# Altium schematic sheet controller.SchDoc: Sunrise Alarm (Clusterwink)
size A4
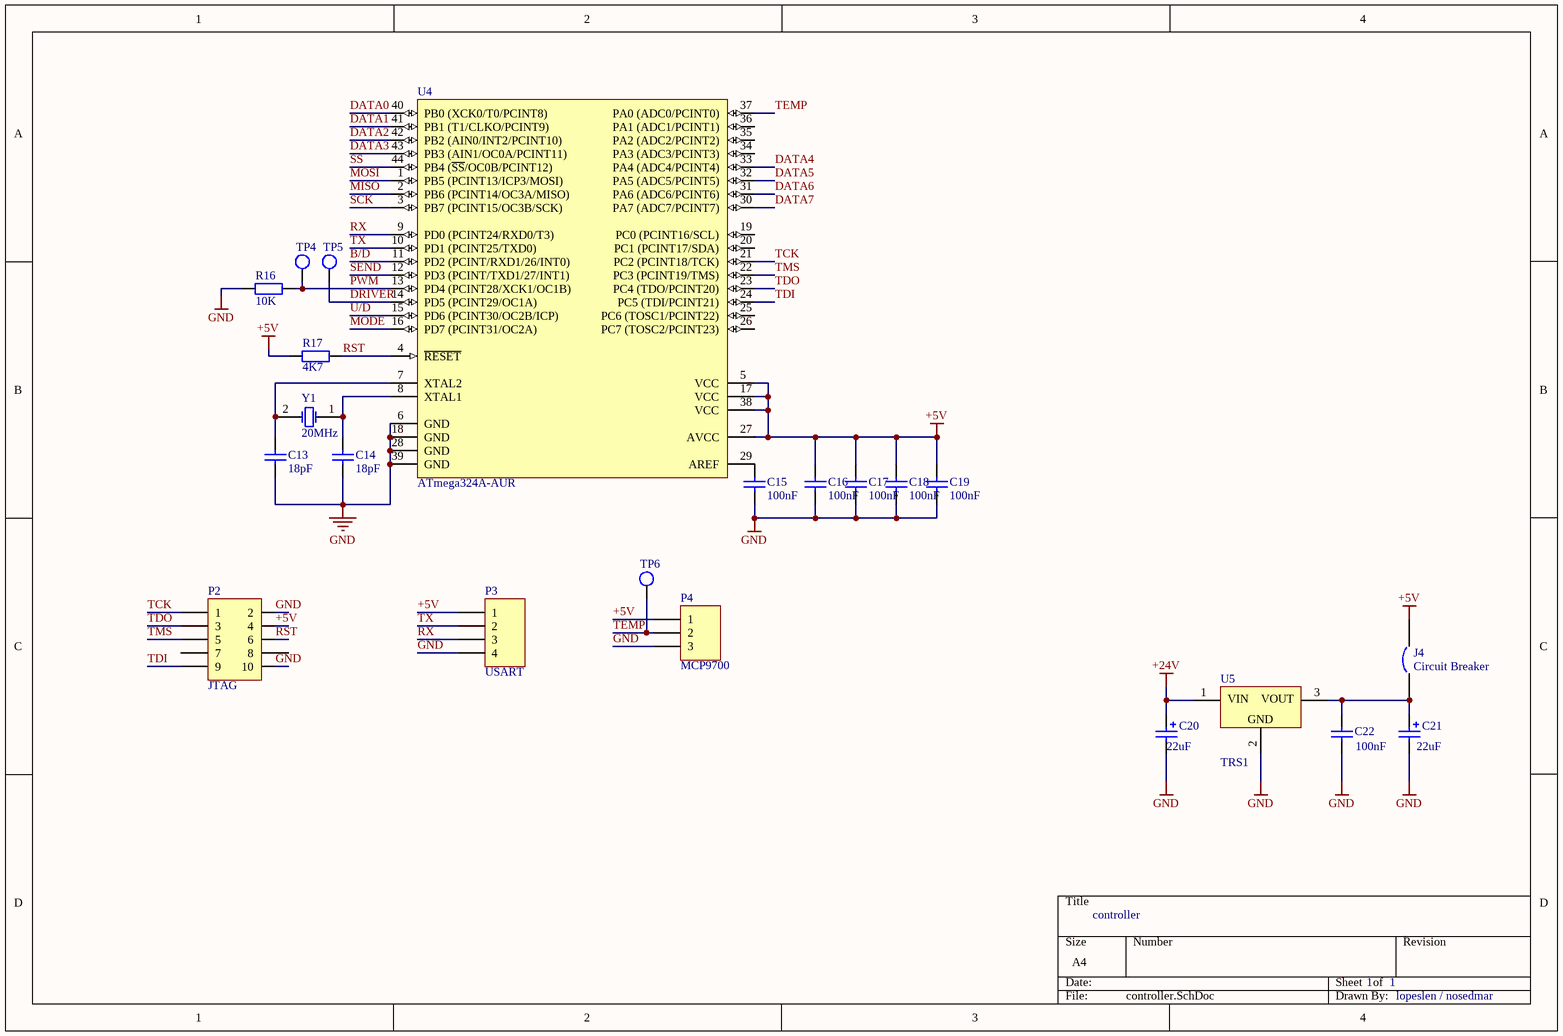
[diagram p0: controller.SchDoc]

## Parts
C13  value 18pF  [6-0805_M]  (hidden comment: Cap)
C14  value 18pF  [6-0805_M]  (hidden comment: Cap)
C15  value 100nF  [6-0805_M]  (hidden comment: Cap)
C16  value 100nF  [6-0805_M]  (hidden comment: Cap)
C17  value 100nF  [6-0805_M]  (hidden comment: Cap)
C18  value 100nF  [6-0805_M]  (hidden comment: Cap)
C19  value 100nF  [6-0805_M]  (hidden comment: Cap)
C20  value 22uF  [EEEFK1H]  (hidden comment: Cap Pol2)
C21  value 22uF  [EEEFK1H]  (hidden comment: Cap Pol2)
C22  value 100nF  [6-0805_M]  (hidden comment: Cap)
J4  Circuit Breaker  [SOLDER_JUMPER_24mil]
P2  JTAG  [HDR2X5]
P3  USART  [HDR1X4]
P4  MCP9700  [HDR1X3]
R16  value 10K  [6-0805_M]  (hidden comment: Res2)
R17  value 4K7  [6-0805_M]  (hidden comment: Res2)
TP4  TestPoint  [MEASUREMENT_POINT]  (value not drawn)
TP5  TestPoint  [MEASUREMENT_POINT]  (value not drawn)
TP6  TestPoint  [MEASUREMENT_POINT]  (value not drawn)
U4  ATmega324A-AUR  [44A_N]
U5  TRS1  [TSR1-2450]
Y1  20MHz  [CRYSTAL]

## Nets
+5V: C16.2 C17.2 C18.2 C19.2 J4.2 P2.4 P3.1 P4.1 R17.2 U4.5(VCC) U4.17(VCC) U4.27(AVCC) U4.38(VCC)
+24V: C20.1 U5.1(+VIN)
GND: C13.1 C14.1 C15.1 C16.1 C17.1 C18.1 C19.1 C20.2 C21.2 C22.1 P2.2 P2.10 P3.4 P4.3 R16.2 U4.6(GND) U4.18(GND) U4.28(GND) U4.39(GND) U5.2(GND)
~{B}/D: U4.11(PD2_(PCINT/RXD1/26/INT0))
DATA0: U4.40(PB0_(XCK0/T0/PCINT8))
DATA1: U4.41(PB1_(T1/CLKO/PCINT9))
DATA2: U4.42(PB2_(AIN0/INT2/PCINT10))
DATA3: U4.43(PB3_(AIN1/OC0A/PCINT11))
DATA4: U4.33(PA4_(ADC4/PCINT4))
DATA5: U4.32(PA5_(ADC5/PCINT5))
DATA6: U4.31(PA6_(ADC6/PCINT6))
DATA7: U4.30(PA7_(ADC7/PCINT7))
DRIVER: TP5.1 U4.14(PD5_(PCINT29/OC1A))
MISO: U4.2(PB6_(PCINT14/OC3A/MISO))
MODE: U4.16(PD7_(PCINT31/OC2A))
MOSI: U4.1(PB5_(PCINT13/ICP3/MOSI))
PWM: R16.1 TP4.1 U4.13(PD4_(PCINT28/XCK1/OC1B))
RST: P2.6 R17.1 U4.4(~{RESET})
RX: P3.3 U4.9(PD0_(PCINT24/RXD0/T3))
~{SS}: U4.44(PB4_(~{SS}/OC0B/PCINT12))
SCK: U4.3(PB7_(PCINT15/OC3B/SCK))
SEND: U4.12(PD3_(PCINT/TXD1/27/INT1))
TCK: P2.1 U4.21(PC2_(PCINT18/TCK))
TDI: P2.9 U4.24(PC5_(TDI/PCINT21))
TDO: P2.3 U4.23(PC4_(TDO/PCINT20))
TEMP: P4.2 TP6.1 U4.37(PA0_(ADC0/PCINT0))
TMS: P2.5 U4.22(PC3_(PCINT19/TMS))
TX: P3.2 U4.10(PD1_(PCINT25/TXD0))
U/D: U4.15(PD6_(PCINT30/OC2B/ICP))
NetC13_2: C13.2 U4.7(XTAL2) Y1.2(OSC2)
NetC14_2: C14.2 U4.8(XTAL1) Y1.1(OSC1)
NetC15_2: C15.2 U4.29(AREF)
NetC21_1: C21.1 C22.2 J4.1 U5.3(+VOUT)

Not connected (* = marked no-connect by the designer): P2 7 8; U4 19(PC0_(PCINT16/SCL)) 20(PC1_(PCINT17/SDA)) 25(PC6_(TOSC1/PCINT22)) 26(PC7_(TOSC2/PCINT23)) 34(PA3_(ADC3/PCINT3)) 35(PA2_(ADC2/PCINT2)) 36(PA1_(ADC1/PCINT1))

## Notes on the sheet
- controller
- 1
- lopeslen / nosedmar
- (in symbol TSR1-2450) VIN; VOUT

## Library data of the parts
C13-C19 C22 = Cap: Capacitor; Published: 8-Jun-2000; LatestRevisionDate: 17-Jul-2002; LatestRevisionNote: Re-released for DXP Platform.; PackageReference: RAD-0.3; Publisher: Altium Limited; PackageDescription: Radial Cap, Thru-Hole; 2 Leads; 0.3 in Pin Spacing
C20 C21 = Cap Pol2: Polarized Capacitor (Axial); Published: 8-Jun-2000; LatestRevisionDate: 17-Jul-2002; LatestRevisionNote: Re-released for DXP Platform.; PackageReference: POLAR0.8; Publisher: Altium Limited; PackageDescription: Polarized Capacitor; 2 Leads
P2 = Header 5X2: Header, 5-Pin, Dual row; LatestRevisionDate: 17-Jul-2002; LatestRevisionNote: Re-released for DXP Platform.; Publisher: Altium Limited
P3 = Header 4: Header, 4-Pin; LatestRevisionDate: 17-Jul-2002; LatestRevisionNote: Re-released for DXP Platform.; Publisher: Altium Limited
P4 = Header 3: Header, 3-Pin; LatestRevisionDate: 17-Jul-2002; LatestRevisionNote: Re-released for DXP Platform.; Publisher: Altium Limited
R16 R17 = Res2: Resistor; Published: 8-Jun-2000; LatestRevisionDate: 17-Jul-2002; LatestRevisionNote: Re-released for DXP Platform.; PackageReference: AXIAL-0.4; Publisher: Altium Limited; PackageDescription: Axial Device, Thru-Hole; 2 Leads; 0.4 in Pin Spacing
U4 = ATmega324A-AUR: 8-bit AVR Microcontroller, 32KB Flash, 1KB EEPROM, 2KB SRAM, 44-pin TQFP, Industrial Grade (-40°C to 85°C), Reel; DatasheetVersion: revC, Jun-2011; PackageVersion: revC, Oct-2010; PackageReference: 44A; PackageDescription: 44-Pin Plastic Thin Profile Quad Flat Pack, 10 x 10 x 1.0 mm Body, 0.8 mm Pitch (TQFP); Code_JEDEC: MS-026-ACB; ComponentLink1Description: Manufacturer URL; ComponentLink1URL: http://www.atmel.com/; ComponentLink2Description: ATmega164A/164PA/324A/324PA/644A/644PA/1284/1284P Datasheet; ComponentLink2URL: http://www.atmel.com/dyn/resources/prod_documents/doc8272.pdf; ComponentLink3Description: ATmega164A/164PA/324A/324PA/644A/644PA/1284/1284P Summary; ComponentLink3URL: http://www.atmel.com/dyn/resources/prod_documents/8272S.pdf
U5 = TSR1-2450: TSR1-2450 DC/DC Step-Down Converter
Y1 = XTAL: Crystal Oscillator; Published: 8-Jun-2000; LatestRevisionDate: 17-Jul-2002; LatestRevisionNote: Re-released for DXP Platform.; PackageReference: R38; Publisher: Altium Limited; PackageDescription: Crystal, Thru-Hole; 2 Leads; Body 3.1 x 8.2 mm (Dia.xH)
J4 = Circuit Breaker: Published: 24-Mar-1999; LatestRevisionDate: 17-Jul-2002; LatestRevisionNote: Re-released for DXP Platform.; PackageReference: SPST-2; Publisher: Altium Limited; PackageDescription: Switch; 2 Leads